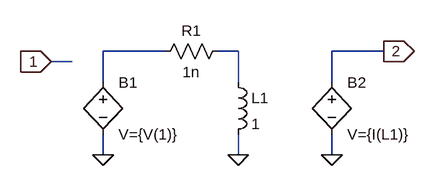
[diagram p0: schematic Integral.asc]
Integral.asc, the LTspice schematic file:
Version 4
SHEET 1 880 680
WIRE 192 112 96 112
WIRE 304 112 272 112
WIRE 528 112 448 112
WIRE 48 128 16 128
WIRE 96 160 96 112
WIRE 304 160 304 112
WIRE 448 160 448 112
WIRE 96 272 96 240
WIRE 304 272 304 240
WIRE 448 272 448 240
FLAG 16 128 1
IOPIN 16 128 In
FLAG 528 112 2
IOPIN 528 112 Out
FLAG 96 272 0
FLAG 304 272 0
FLAG 448 272 0
SYMBOL bv 96 144 R0
SYMATTR InstName B1
SYMATTR Value V={V(1)}
SYMBOL bv 448 144 R0
SYMATTR InstName B2
SYMATTR Value V={I(L1)}
SYMBOL res 288 96 R90
WINDOW 0 0 56 VBottom 2
WINDOW 3 32 56 VTop 2
SYMATTR InstName R1
SYMATTR Value 1n
SYMBOL ind 288 144 R0
SYMATTR InstName L1
SYMATTR Value 1

The netlist it stands for:
* Integral.asc
B1 N001 0 V={V(1)}
B2 2 0 V={I(L1)}
R1 N002 N001 1n
L1 N002 0 1
.backanno
.end